# EAGLE design Nonaddressable Controller (EAGLE 7.7.0)
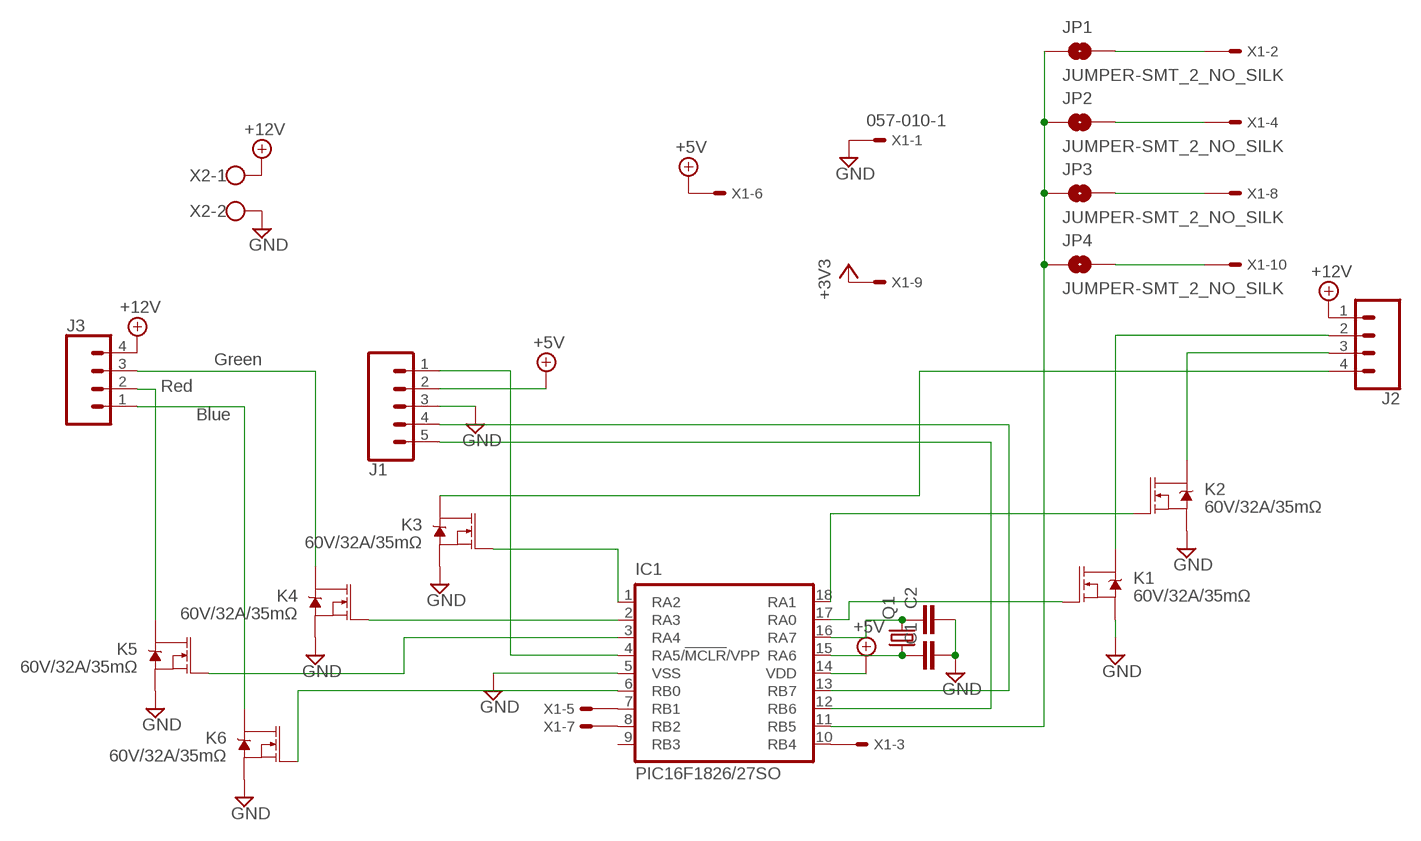
[diagram p0: schematic, sheet 1]

## Parts
C1  C-EUC1206  [C1206]
C2  C-EUC1206  [C1206]
IC1  PIC16F1826/27SO  [SO-18W]
J1  CONN_05  [1X05]
J2  CONN_04  [1X04]
J3  CONN_04  [1X04]
JP1  JUMPER-SMT_2_NO_SILK  [SMT-JUMPER_2_NO_SILK]
JP2  JUMPER-SMT_2_NO_SILK  [SMT-JUMPER_2_NO_SILK]
JP3  JUMPER-SMT_2_NO_SILK  [SMT-JUMPER_2_NO_SILK]
JP4  JUMPER-SMT_2_NO_SILK  [SMT-JUMPER_2_NO_SILK]
K1  60V/32A/35mΩ  MOSFET-NCH-FQP30N06L  [TO220V]
K2  60V/32A/35mΩ  MOSFET-NCH-FQP30N06L  [TO220V]
K3  60V/32A/35mΩ  MOSFET-NCH-FQP30N06L  [TO220V]
K4  60V/32A/35mΩ  MOSFET-NCH-FQP30N06L  [TO220V]
K5  60V/32A/35mΩ  MOSFET-NCH-FQP30N06L  [TO220V]
K6  60V/32A/35mΩ  MOSFET-NCH-FQP30N06L  [TO220V]
Q1  CRYSTALHC49S  [HC49/S]
X1  057-010-1  [057-010-1]
X2  W237-102  [W237-102]

## Nets
+3V3: X1.9
+5V: IC1.14(VDD) J1.2 X1.6
+12V: J2.1 J3.4 X2.1
GND: C1.2 C2.2 IC1.5(VSS) J1.3 K1.3(S) K2.3(S) K3.3(S) K4.3(S) K5.3(S) K6.3(S) X1.1 X2.2
N$1: IC1.10(RB4) X1.3
N$2: IC1.7(RB1) X1.5
N$3: IC1.8(RB2) X1.7
N$4: JP1.2 X1.2
N$5: JP2.2 X1.4
N$6: JP3.2 X1.8
N$7: JP4.2 X1.10
N$8: IC1.11(RB5) JP1.1 JP2.1 JP3.1 JP4.1
N$9: C1.1 IC1.15(RA6) Q1.1
N$10: C2.1 IC1.16(RA7) Q1.2
N$11: IC1.4(RA5/!MCLR!/VPP) J1.1
N$12: IC1.13(RB7) J1.4
N$13: IC1.12(RB6) J1.5
N$14: IC1.17(RA0) K1.1(G)
N$15: IC1.18(RA1) K2.1(G)
N$16: IC1.1(RA2) K3.1(G)
N$17: IC1.2(RA3) K4.1(G)
N$18: IC1.3(RA4) K5.1(G)
N$19: IC1.6(RB0) K6.1(G)
N$20: J2.2 K1.2(D)
N$21: J2.3 K2.2(D)
N$22: J2.4 K3.2(D)
N$23: J3.3 K4.2(D)
N$24: J3.2 K5.2(D)
N$25: J3.1 K6.2(D)
Unconnected: IC1.9(RB3)

## Notes on the sheet
- Green
- Red
- Blue

## Library data of the parts
C1 C2 = resistor:C-EU: CAPACITOR, European symbol
IC1 = microchip:PIC16*F1826/27: 18/20/28-Pin Flash Microcontrollers with nanoWatt XLP Technology Source: www.microchip.com PIC16F1827.pdf
J1 = SparkFun-Connectors:CONN_05: Multi connection point. Often used as Generic Header-pin footprint for 0.1 inch spaced/style header connections On any of the 0.1 inch spaced packages, you can populate with these: Break Away Headers - Straight <https://www.sparkfun.com/products/116> (PRT-00116) Break Away Male Headers - Right Angle <https://www.sparkfun.com/products/553> (PRT-00553) Female Headers <https://www.sparkfun.com/products/115> (PRT-00115) Break Away Headers - Machine Pin <https://www.sparkfun.com/products/117> (PRT-00117) Break Away Female Headers - Swiss Machine Pin <https://www.sparkfun.com/products/743> (PRT-00743) For SCREWTERMINALS and SPRING TERMINALS visit here: Screw Terimnals on SparkFun.com <https://www.sparkfun.com/search/results?term=Screw+Terminals> (5mm/3.5mm/2.54mm spacing) This device is also useful as a general connection point to wire up your design to another part of your project. Our various solder wires solder well into these plated through hole pads. Hook-Up Wire - Assortment (Stranded, 22 AWG) <https://www.sparkfun.com/products/11375> (PRT-11375) Hook-Up Wire - Assortment (Solid Core, 22 AWG) <https://www.sparkfun.com/products/11367> (PRT-11367) View the entire wire category on our website here <https://www.sparkfun.com/categories/141> Special notes: Molex polarized connector foot print use with SKU : PRT-08231 with associated crimp pins and housings. 1MM SMD Version SKU: PRT-10208
J2 J3 = SparkFun-Connectors:CONN_04: Multi connection point. Often used as Generic Header-pin footprint for 0.1 inch spaced/style header connections On any of the 0.1 inch spaced packages, you can populate with these: Break Away Headers - Straight <https://www.sparkfun.com/products/116> (PRT-00116) Break Away Male Headers - Right Angle <https://www.sparkfun.com/products/553> (PRT-00553) Female Headers <https://www.sparkfun.com/products/115> (PRT-00115) Break Away Headers - Machine Pin <https://www.sparkfun.com/products/117> (PRT-00117) Break Away Female Headers - Swiss Machine Pin <https://www.sparkfun.com/products/743> (PRT-00743) For SCREWTERMINALS and SPRING TERMINALS visit here: Screw Terimnals on SparkFun.com <https://www.sparkfun.com/search/results?term=Screw+Terminals> (5mm/3.5mm/2.54mm spacing) This device is also useful as a general connection point to wire up your design to another part of your project. Our various solder wires solder well into these plated through hole pads. Hook-Up Wire - Assortment (Stranded, 22 AWG) <https://www.sparkfun.com/products/11375> (PRT-11375) Hook-Up Wire - Assortment (Solid Core, 22 AWG) <https://www.sparkfun.com/products/11367> (PRT-11367) View the entire wire category on our website here <https://www.sparkfun.com/categories/141> Special notes: Molex polarized connector foot print use with SKU : PRT-08231 with associated crimp pins and housings. 1MM SMD Version SKU: PRT-10208; PROD_ID: CONN-09696
JP1-JP4 = SparkFun-Jumpers:JUMPER-SMT_2_NO: Normally open jumper This jumper has two pads in close proximity to each other. Apply solder to close the connection. Round pads are easier to solder for beginners, but are a lot larger. SparkFun Product that uses the round pads: SparkFun EL Sequencer <https://www.sparkfun.com/products/12781>
K1-K6 = SparkFun-DiscreteSemi:MOSFET-NCH: N-channel MOSFETs Voltage controlled devices that allow control of high current outputs. SparkFun Products: SparkFun OpenScale <https://www.sparkfun.com/products/13261> SparkFun Digital Sandbox <https://www.sparkfun.com/products/12651> SparkFun Monster Moto Shield <https://www.sparkfun.com/products/10182> SparkFun MOSFET Power Controller <https://www.sparkfun.com/products/11214>; PROD_ID: TRANS-10060
Q1 = crystal:CRYSTAL: CRYSTAL; OC_FARNELL: 1667008; OC_NEWARK: unknown
X1 = con-panduit:057-010-: CONNECTOR 10-pin series 057 contact pc board low profile headers; OC_FARNELL: unknown; OC_NEWARK: unknown
X2 = con-wago-500:W237-102: WAGO SCREW CLAMP; MPN: 237-102; OC_FARNELL: unknown; OC_NEWARK: 70K9898

## Board
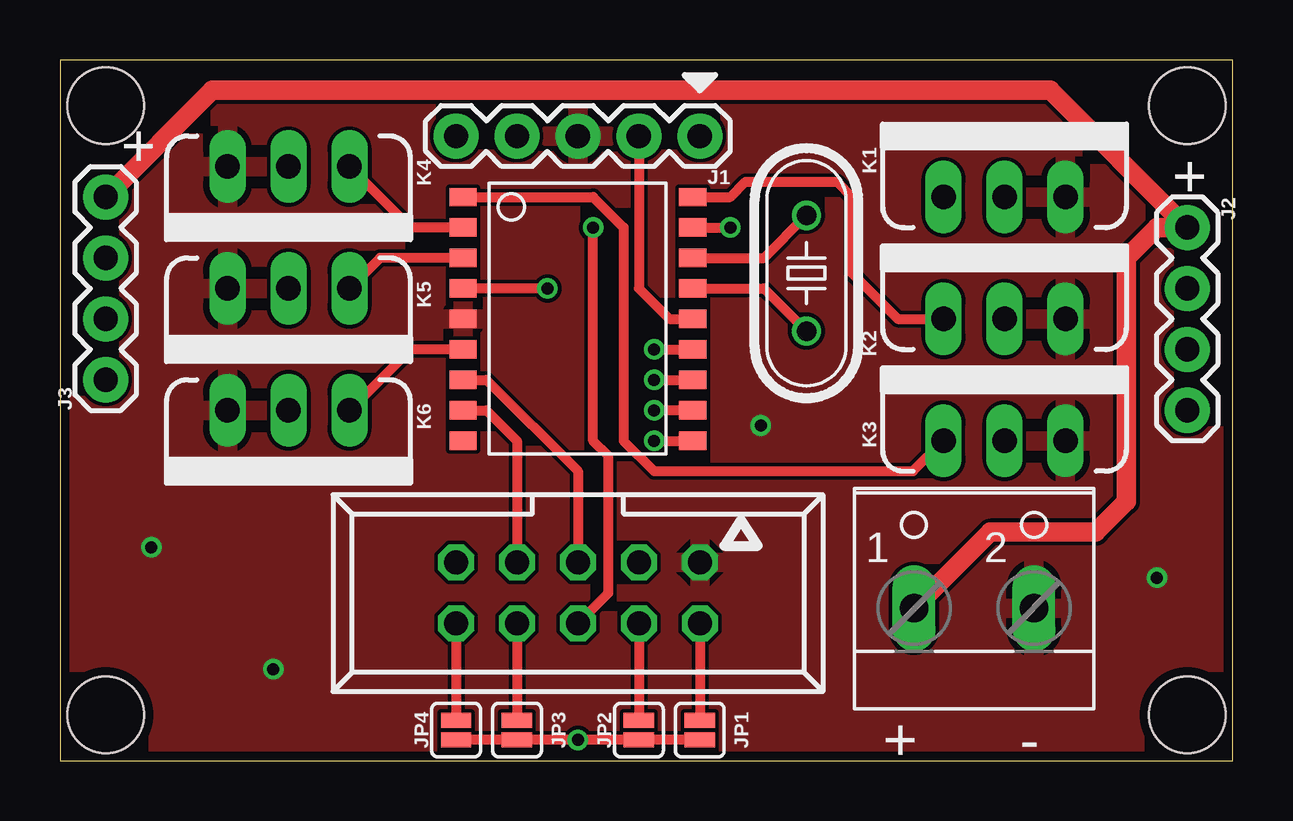
[diagram p1: board, top side]
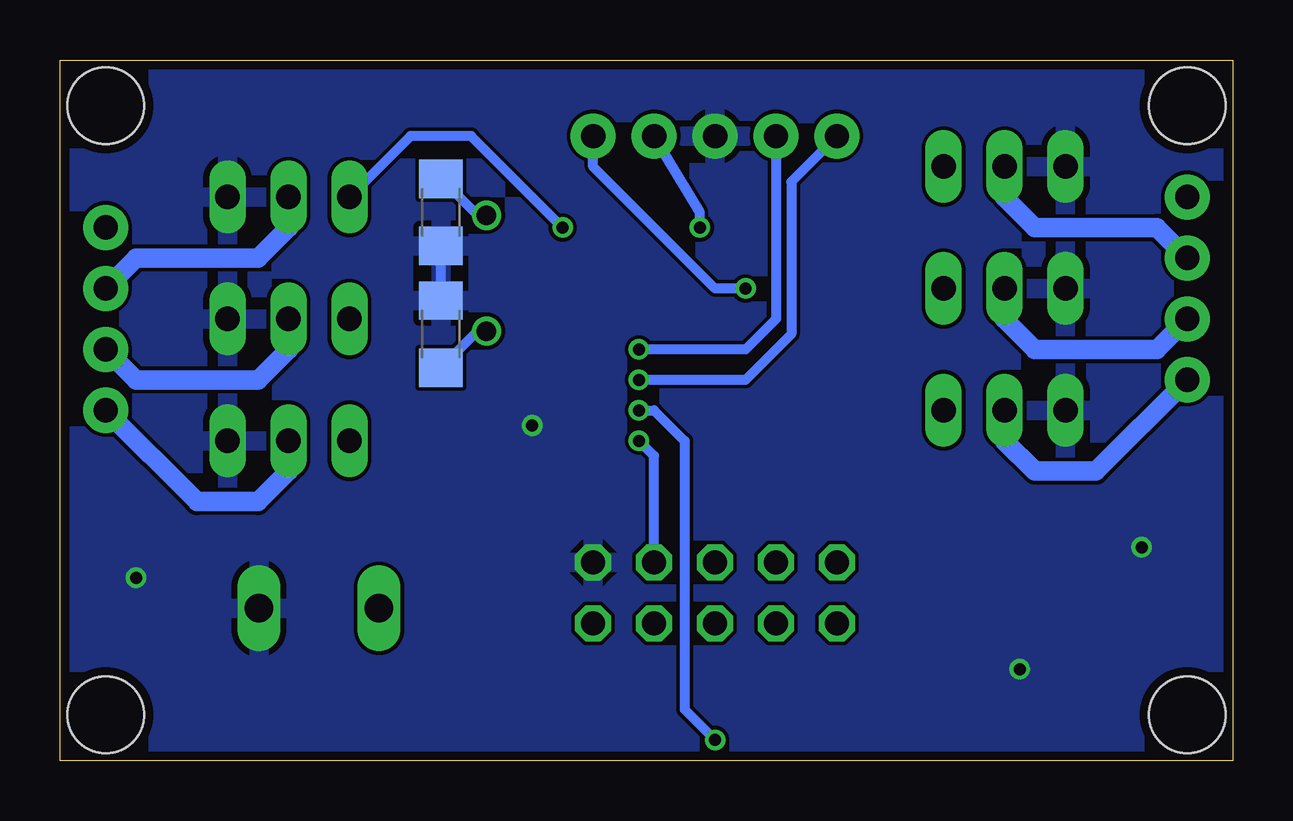
[diagram p2: board, bottom side, seen from below]

Size 48.9 x 29.21 mm. Coordinates in mm from the lower left corner, seen from the top.
Outline: 0,0 48.9,0 48.9,29.21 0,29.21 0,0
Copper layers (1*16): Top 0.0356mm / dielectric 1.5011mm / Bottom 0.0356mm
Design rules "Oshpark": minimum track width 6mil, minimum drill 13mil, track to track 6mil, track to pad 6mil, pad to pad 6mil, via to via 6mil, smd to smd 6mil, copper to edge 15mil, drill to drill 6mil, minimum pad ring 7mil, minimum via ring 7mil, stop-mask expansion 3mil, vias tented up to drill 0mil, thermal gap 10mil
Holes 3.2 mm at 1.91,1.91 46.99,1.91 1.91,27.3 46.99,27.3

### Footprints (pad centres in the part's own frame; a part is rotated, then mirrored left to right if it is on the bottom)
C1206 = smd 1.6 x 1.8: 1 -1.4,0; 2 1.4,0
SO-18W = smd 0.762 x 1.143: 1 -5.08,-4.788; 2 -3.81,-4.788; 3 -2.54,-4.788; 4 -1.27,-4.788; 5 0,-4.788; 6 1.27,-4.788; 7 2.54,-4.788; 8 3.81,-4.788; 9 5.08,-4.788; 10 5.08,4.788; 11 3.81,4.788; 12 2.54,4.788; 13 1.27,4.788; 14 0,4.788; 15 -1.27,4.788; 16 -2.54,4.788; 17 -3.81,4.788; 18 -5.08,4.788
1X05 = drill 1.016 pad 1.88: 1 0,0; 2 2.54,0; 3 5.08,0; 4 7.62,0; 5 10.16,0
1X04 = drill 1.016 pad 1.88: 1 0,0; 2 2.54,0; 3 5.08,0; 4 7.62,0
SMT-JUMPER_2_NO_SILK = smd 0.635 x 1.27: 1 -0.406,0; 2 0.406,0
TO220V = drill 1.016 long: 1 -2.54,0; 2 0,0; 3 2.54,0
HC49/S = drill 0.813: 1 -2.413,0; 2 2.413,0
057-010-1 = drill 1 octagon: 1 -5.08,-1.27; 2 -5.08,1.27; 3 -2.54,-1.27; 4 -2.54,1.27; 5 0,-1.27; 6 0,1.27; 7 2.54,-1.27; 8 2.54,1.27; 9 5.08,-1.27; 10 5.08,1.27
W237-102 = drill 1.194 long: 1 -2.5,-1.27; 2 2.5,-1.27

### Placement (x,y rotation side)
C1  33.02,17.78 90 bottom
C2  33.02,22.86 270 bottom
IC1  21.59,18.41 270 top
J1  26.67,26.04 180 top
J2  46.99,22.23 270 top
J3  1.91,15.88 90 top
JP1  26.67,1.27 90 top
JP2  24.13,1.27 90 top
JP3  19.05,1.27 90 top
JP4  16.51,1.27 90 top
K1  39.37,23.5 0 top
K2  39.37,18.41 0 top
K3  39.37,13.34 0 top
K4  9.53,24.77 180 top
K5  9.53,19.68 180 top
K6  9.53,14.61 180 top
Q1  31.11,20.32 90 top
X1  21.59,6.99 180 top
X2  38.1,7.62 0 top

### Tracks (layer width: path | path; a pad name or v marks a point on that pad's centre or on a via)
+5V  (via drill 0.5)
  Top 0.406: J1.2 24.13,19.68 25.4,18.41 IC1.14 | X1.6 22.86,6.99 22.86,12.7 22.23,13.34 v22.23,22.23
  Bottom 0.406: v22.23,22.23 22.23,22.86 J1.2
+12V
  Top 0.813: X2.1 38.77,9.53 43.18,9.53 44.45,10.79 44.45,20.95 45.72,22.23 J2.1 41.27,27.94 6.35,27.94 J3.4
GND  (via drill 0.5)
  Bottom 0.406: C1.2 C2.2
  other vias: 3.81,8.89 8.89,3.81 45.72,7.62 29.21,13.97
  pour Bottom: -20.32,30.48 59.69,30.48 59.69,-1.27 -20.32,-1.27
  pour Top: -2.54,40.64 -2.54,-12.7 50.8,-12.7 50.8,40.64 -1.27,40.64
N$1  (via drill 0.5)
  Top 0.406: v24.77,13.34 IC1.10
  Bottom 0.406: X1.3 24.13,12.7 v24.77,13.34
N$2
  Top 0.406: IC1.7 17.78,15.88 21.59,12.06 X1.5
N$3
  Top 0.406: IC1.8 17.78,14.61 19.05,13.34 X1.7
N$4
  Top 0.406: X1.2 JP1.2
N$5
  Top 0.406: X1.4 JP2.2
N$6
  Top 0.406: X1.8 JP3.2
N$7
  Top 0.406: X1.10 JP4.2
N$8  (via drill 0.5)
  Top 0.406: JP1.1 JP2.1 v21.59,0.86 JP3.1 JP4.1 | IC1.11 v24.77,14.61
  Bottom 0.406: v24.77,14.61 24.13,14.61 22.86,13.34 22.86,2.13 v21.59,0.86
N$9
  Top 0.406: IC1.15 29.34,19.68 Q1.1
  Bottom 0.406: Q1.1 31.49,17.91 C1.1
N$10
  Top 0.406: IC1.16 29.34,20.95 Q1.2
  Bottom 0.406: Q1.2 31.49,22.73 C2.1
N$11  (via drill 0.5)
  Top 0.406: v20.32,19.68 IC1.4
  Bottom 0.406: v20.32,19.68 21.59,19.68 26.67,24.77 J1.1
N$12  (via drill 0.5)
  Top 0.406: v24.77,17.14 IC1.13
  Bottom 0.406: J1.4 19.05,18.41 20.32,17.14 v24.77,17.14
N$13  (via drill 0.5)
  Top 0.406: v24.77,15.88 IC1.12
  Bottom 0.406: J1.5 18.41,24.13 18.41,17.78 20.32,15.88 v24.77,15.88
N$14  (via drill 0.5)
  Top 0.406: IC1.17 v27.94,22.23
  Bottom 0.406: v27.94,22.23 31.75,26.04 34.29,26.04 K1.1
N$15
  Top 0.406: IC1.18 27.94,23.5 28.57,24.13 32.38,24.13 33.02,23.5 33.02,20.32 34.92,18.41 K2.1
N$16
  Top 0.406: IC1.1 22.23,23.5 23.5,22.23 23.5,13.34 24.77,12.06 35.56,12.06 K3.1
N$17
  Top 0.406: IC1.2 14.61,22.23 K4.1
N$18
  Top 0.406: IC1.3 13.34,20.95 K5.1
N$19
  Top 0.406: IC1.6 14.61,17.14 K6.1
N$20
  Bottom 0.813: K1.2 39.37,22.23 40.64,20.95 45.72,20.95 J2.2
N$21
  Bottom 0.813: K2.2 39.37,17.14 40.64,15.88 45.72,15.88 J2.3
N$22
  Bottom 0.813: K3.2 39.37,12.06 40.64,10.79 43.18,10.79 J2.4
N$23
  Bottom 0.813: K4.2 9.53,23.5 8.26,22.23 3.17,22.23 J3.3
N$24
  Bottom 0.813: K5.2 9.53,18.41 8.26,17.14 3.17,17.14 J3.2
N$25
  Bottom 0.813: K6.2 9.53,13.34 8.26,12.06 5.71,12.06 J3.1

### Text on the board
tPlace: + | + | + | -